# EAGLE design BlueESC (EAGLE 7.4.0)

## Sheet 1 of 6
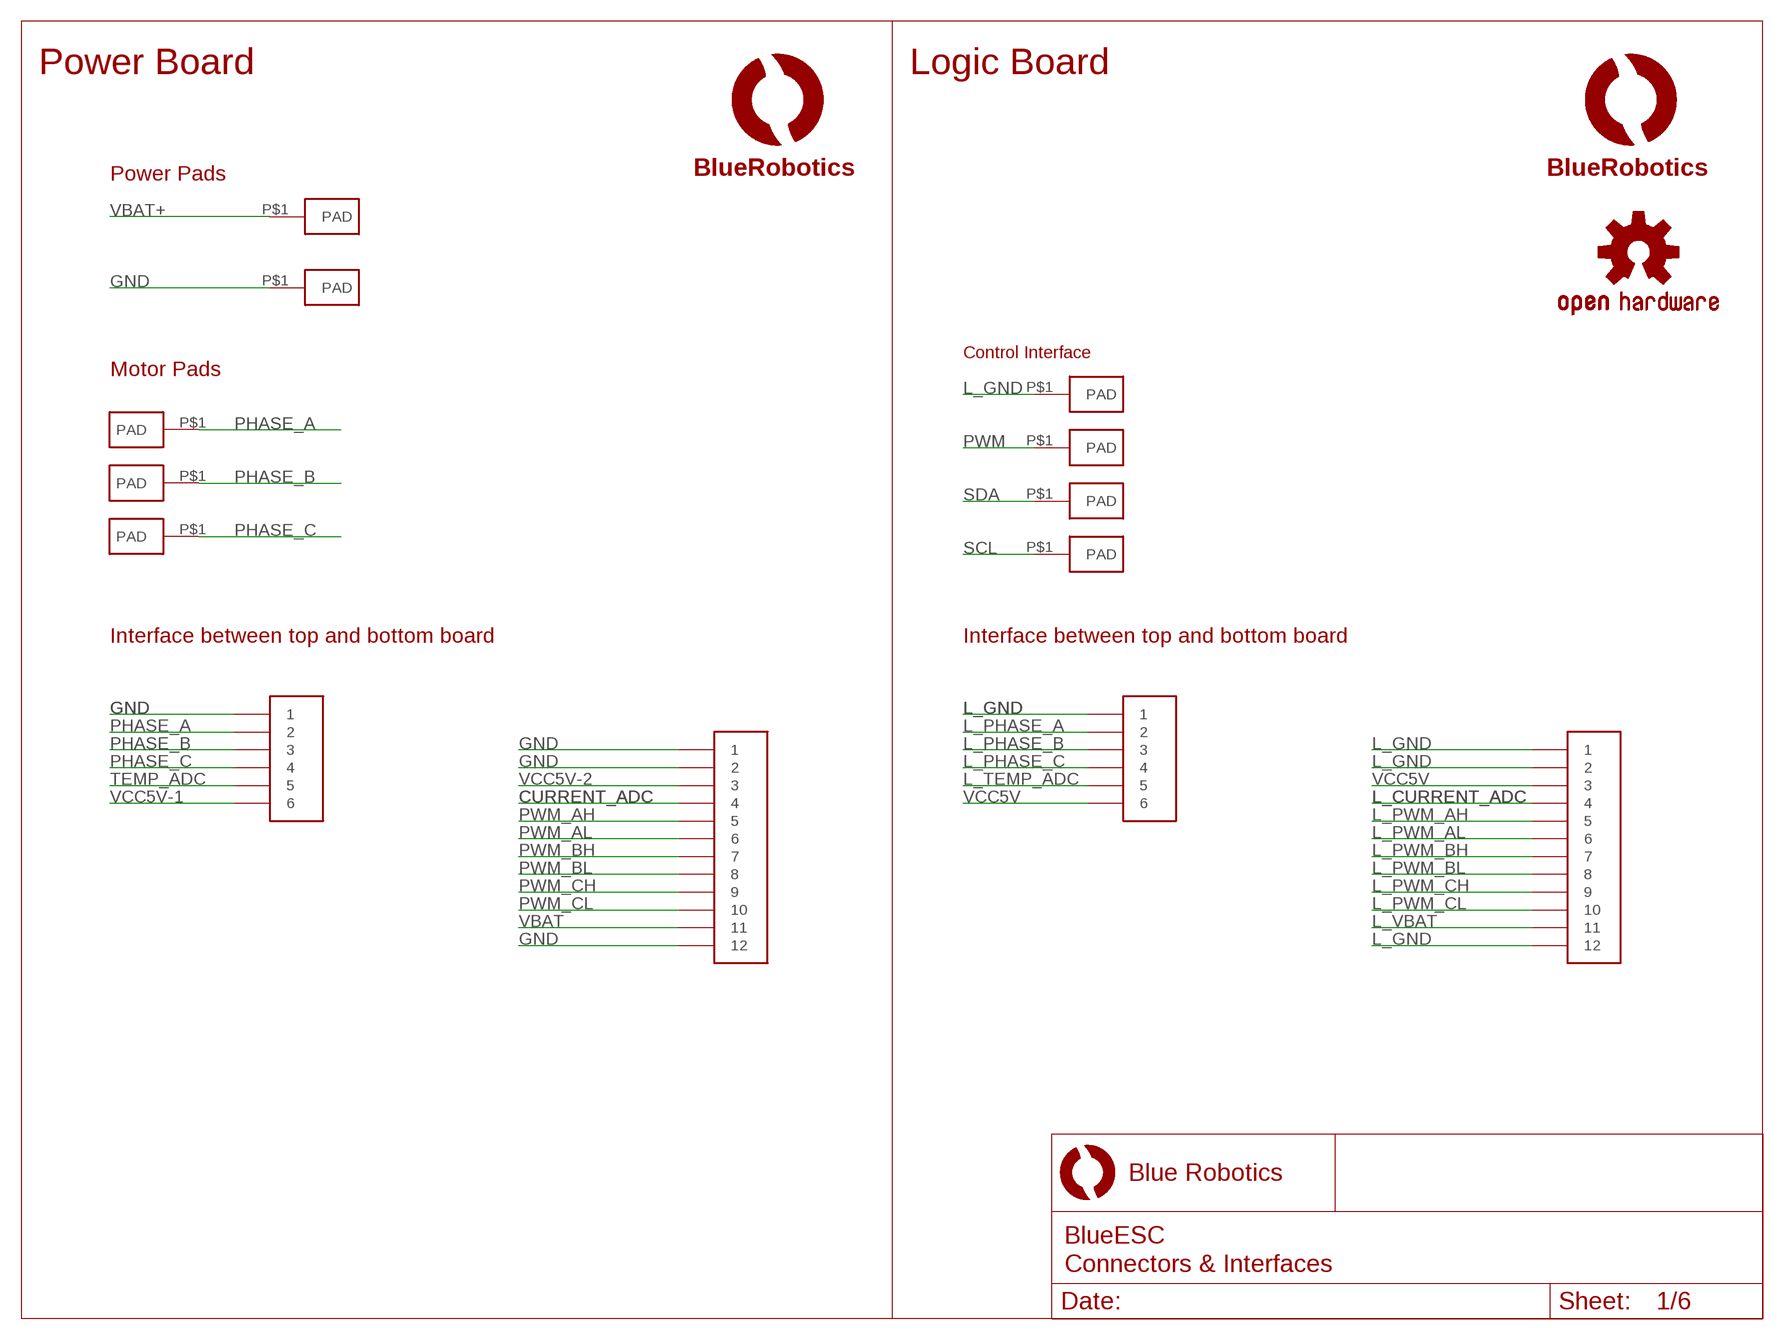
[diagram p0: schematic, sheet 1]

### Parts
LOGO1  OSHW-LOGOS  [OSHW-LOGO-S]
U$1  PADPTH-MED  [PAD-PTH-MED-1]
U$2  PADPTH-MED  [PAD-PTH-MED-1]
U$4  HEADER-62MM  [HEADER-2MM-6POS]
U$5  PAD18AWG  [PAD-PTH-18AWG-1]
U$6  PAD18AWG  [PAD-PTH-18AWG-1]
U$7  PAD18AWG  [PAD-PTH-18AWG-1]
U$8  HEADER-122MM  [HEADER-2MM-12POS]
U$9  LOGOBR-LOGO-S  [BR-LOGO-SMALL]
U$10  LOGOBR-LOGO-M  [BR-LOGO-MEDIUM]
U$11  PAD1.5X3MM  [PAD-1.5X3MM]
U$12  PAD1.5X3MM  [PAD-1.5X3MM]
U$13  PAD1.5X3MM  [PAD-1.5X3MM]
U$14  PAD1.5X3MM  [PAD-1.5X3MM]
U$16  HEADER-62MM  [HEADER-2MM-6POS]
U$17  HEADER-122MM  [HEADER-2MM-12POS]

### Nets
CURRENT_ADC: U$8.P$4 ; also sheet 3
GND: U$2.P$1(PAD) U$4.P$1 U$8.P$1 U$8.P$2 U$8.P$12 ; also sheet 3,4,6
L_CURRENT_ADC: U$17.P$4 ; also sheet 3
L_GND: U$11.P$1(PAD) U$16.P$1 U$17.P$1 U$17.P$2 U$17.P$12 ; also sheet 2,3,4,5
L_PHASE_A: U$16.P$2 ; also sheet 5
L_PHASE_B: U$16.P$3 ; also sheet 5
L_PHASE_C: U$16.P$4 ; also sheet 5
L_PWM_AH: U$17.P$5 ; also sheet 2
L_PWM_AL: U$17.P$6 ; also sheet 2
L_PWM_BH: U$17.P$7 ; also sheet 2
L_PWM_BL: U$17.P$8 ; also sheet 2
L_PWM_CH: U$17.P$9 ; also sheet 2
L_PWM_CL: U$17.P$10 ; also sheet 2
L_TEMP_ADC: U$16.P$5 ; also sheet 2
L_VBAT: U$17.P$11 ; also sheet 3,4
PHASE_A: U$4.P$2 U$5.P$1(PAD) ; also sheet 6
PHASE_B: U$4.P$3 U$6.P$1(PAD) ; also sheet 6
PHASE_C: U$4.P$4 U$7.P$1(PAD) ; also sheet 6
PWM: U$14.P$1(PAD) ; also sheet 2
PWM_AH: U$8.P$5 ; also sheet 6
PWM_AL: U$8.P$6 ; also sheet 6
PWM_BH: U$8.P$7 ; also sheet 6
PWM_BL: U$8.P$8 ; also sheet 6
PWM_CH: U$8.P$9 ; also sheet 6
PWM_CL: U$8.P$10 ; also sheet 6
SCL: U$13.P$1(PAD) ; also sheet 2
SDA: U$12.P$1(PAD) ; also sheet 2
TEMP_ADC: U$4.P$5 ; also sheet 3
VBAT: U$8.P$11 ; also sheet 3,6
VBAT+: U$1.P$1(PAD) ; also sheet 3,4
VCC5V: U$16.P$6 U$17.P$3 ; also sheet 2,4
VCC5V-1: U$4.P$6 ; also sheet 3
VCC5V-2: U$8.P$3 ; also sheet 3

### Notes on the sheet
- Power Board | Logic Board
- Power Pads
- Control Interface
- Motor Pads
- Interface between top and bottom board | Interface between top and bottom board

## Sheet 2 of 6
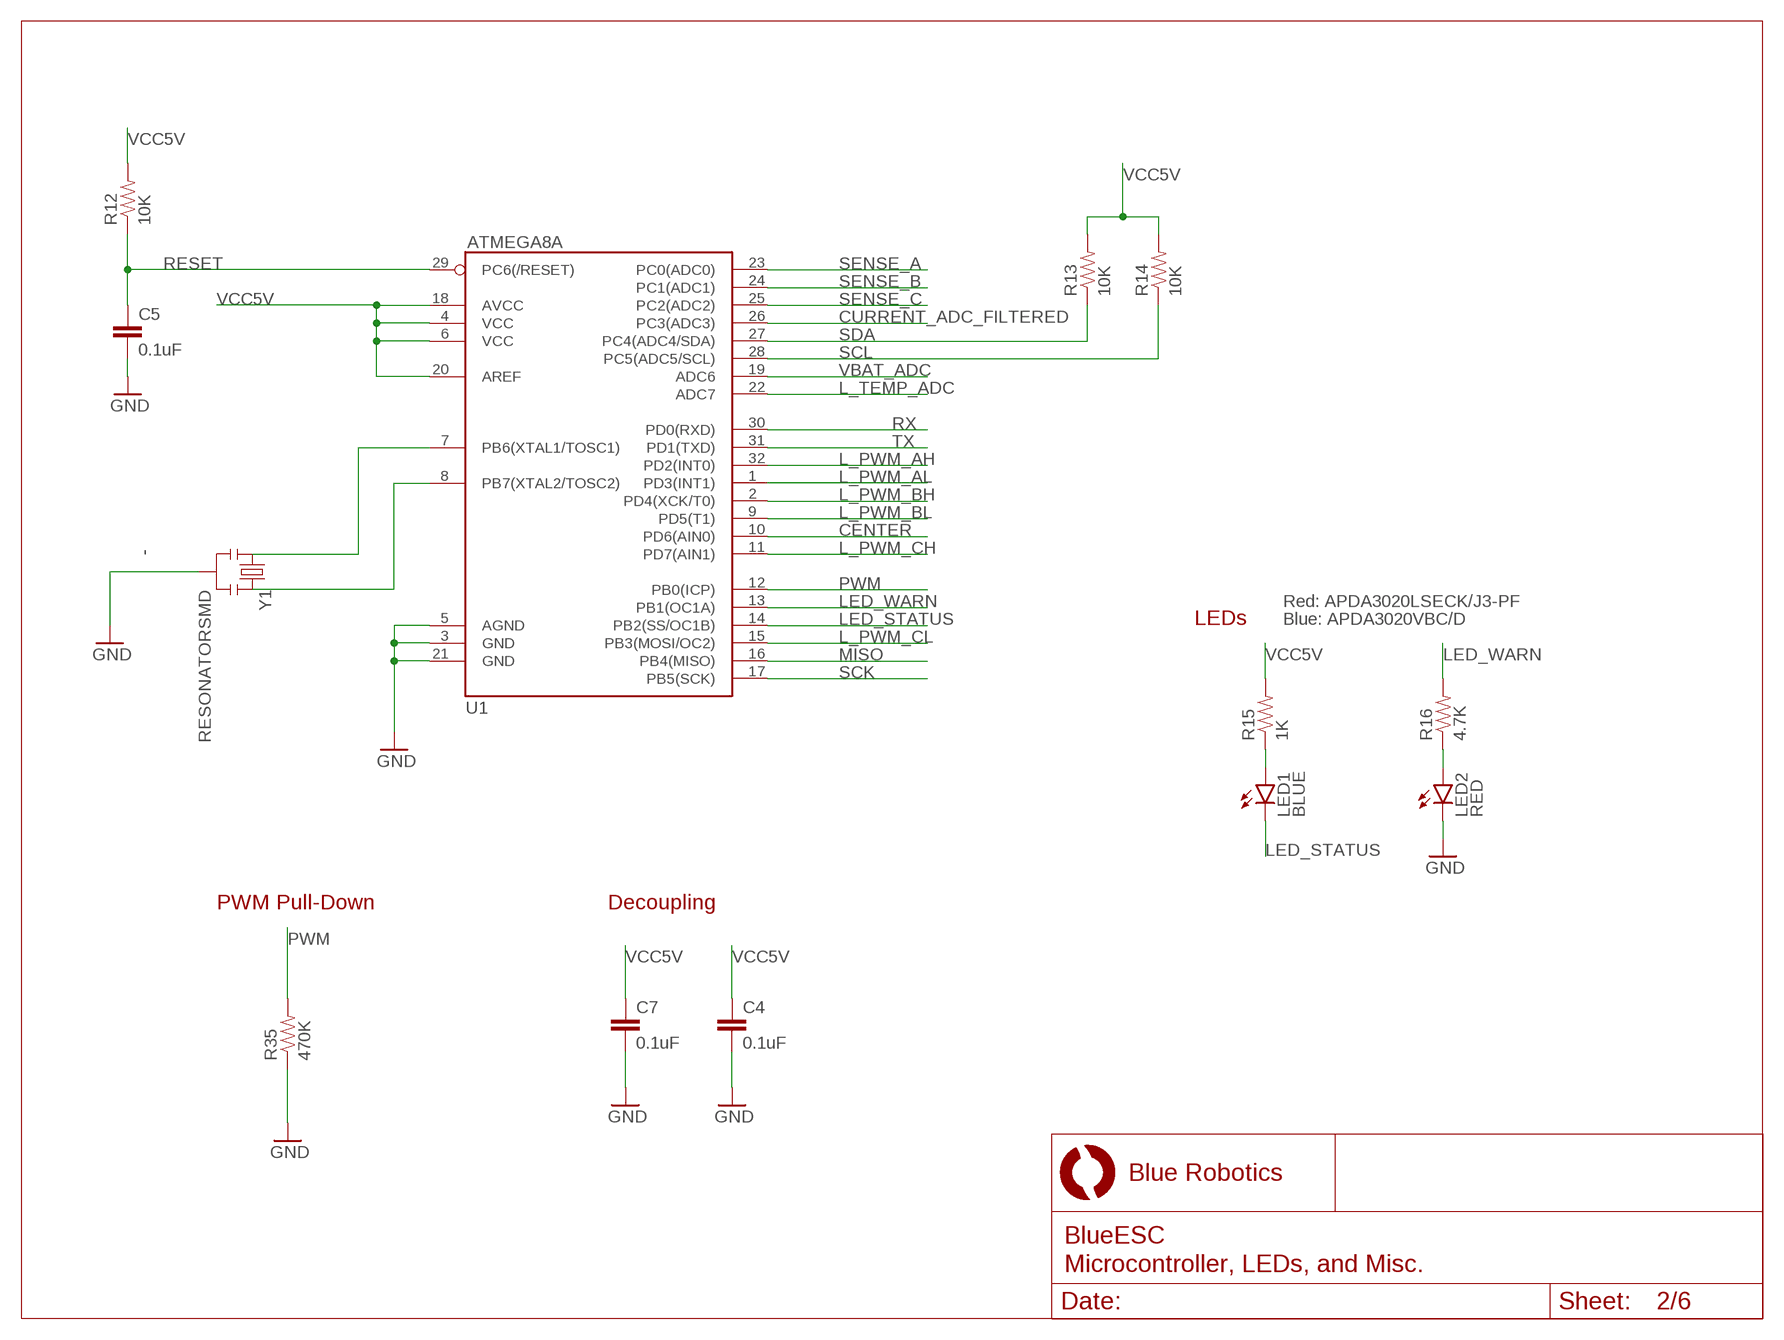
[diagram p1: schematic, sheet 2]

### Parts
C4  0.1uF  CAP0603-CAP  [0603-CAP]
C5  0.1uF  CAP0603-CAP  [0603-CAP]
C7  0.1uF  CAP0603-CAP  [0603-CAP]
LED1  BLUE  LED3X2-RA  [SMT-LED-3X2-RA]
LED2  RED  LED3X2-RA  [SMT-LED-3X2-RA]
R12  10K  33KOHM1/10W1%(0603)  [0603-RES]
R13  10K  33KOHM1/10W1%(0603)  [0603-RES]
R14  10K  33KOHM1/10W1%(0603)  [0603-RES]
R15  1K  RESISTOR0603-RES  [0603-RES]
R16  4.7K  RESISTOR0603-RES  [0603-RES]
R35  470K  RESISTOR0603-RES  [0603-RES]
U1  ATMEGA168  [TQFP32-08]
Y1  RESONATORSMD  [RESONATOR-SMD]

### Nets
CENTER: U1.10(PD6(AIN0)) ; also sheet 5
CURRENT_ADC_FILTERED: U1.26(PC3(ADC3)) ; also sheet 3
L_GND: C4.2 C5.2 C7.2 LED2.2(C) R35.1 U1.3(GND) U1.5(AGND) U1.21(GND) Y1.2 ; supply symbol labelled GND ; also sheet 1,3,4,5
L_PWM_AH: U1.32(PD2(INT0)) ; also sheet 1
L_PWM_AL: U1.1(PD3(INT1)) ; also sheet 1
L_PWM_BH: U1.2(PD4(XCK/T0)) ; also sheet 1
L_PWM_BL: U1.9(PD5(T1)) ; also sheet 1
L_PWM_CH: U1.11(PD7(AIN1)) ; also sheet 1
L_PWM_CL: U1.15(PB3(MOSI/OC2)) ; also sheet 1
L_TEMP_ADC: U1.22(ADC7) ; also sheet 1
LED_STATUS: LED1.2(C) U1.14(PB2(SS/OC1B))
LED_WARN: R16.2 U1.13(PB1(OC1A))
MISO: U1.16(PB4(MISO))
N$3: LED2.1(A) R16.1
N$10: U1.7(PB6(XTAL1/TOSC1)) Y1.1
N$11: U1.8(PB7(XTAL2/TOSC2)) Y1.3
N$16: LED1.1(A) R15.1
PWM: R35.2 U1.12(PB0(ICP)) ; also sheet 1
RESET: C5.1 R12.1 U1.29(PC6(/RESET))
RX: U1.30(PD0(RXD))
SCK: U1.17(PB5(SCK))
SCL: R14.1 U1.28(PC5(ADC5/SCL)) ; also sheet 1
SDA: R13.1 U1.27(PC4(ADC4/SDA)) ; also sheet 1
SENSE_A: U1.23(PC0(ADC0)) ; also sheet 5
SENSE_B: U1.24(PC1(ADC1)) ; also sheet 5
SENSE_C: U1.25(PC2(ADC2)) ; also sheet 5
TX: U1.31(PD1(TXD))
VBAT_ADC: U1.19(ADC6) ; also sheet 3
VCC5V: C4.1 C7.1 R12.2 R13.2 R14.2 R15.2 U1.4(VCC) U1.6(VCC) U1.18(AVCC) U1.20(AREF) ; also sheet 1,4

### Notes on the sheet
- ATMEGA8A
- Red: APDA3020LSECK/J3-PF
- LEDs | Blue: APDA3020VBC/D
- PWM Pull-Down | Decoupling

## Sheet 3 of 6
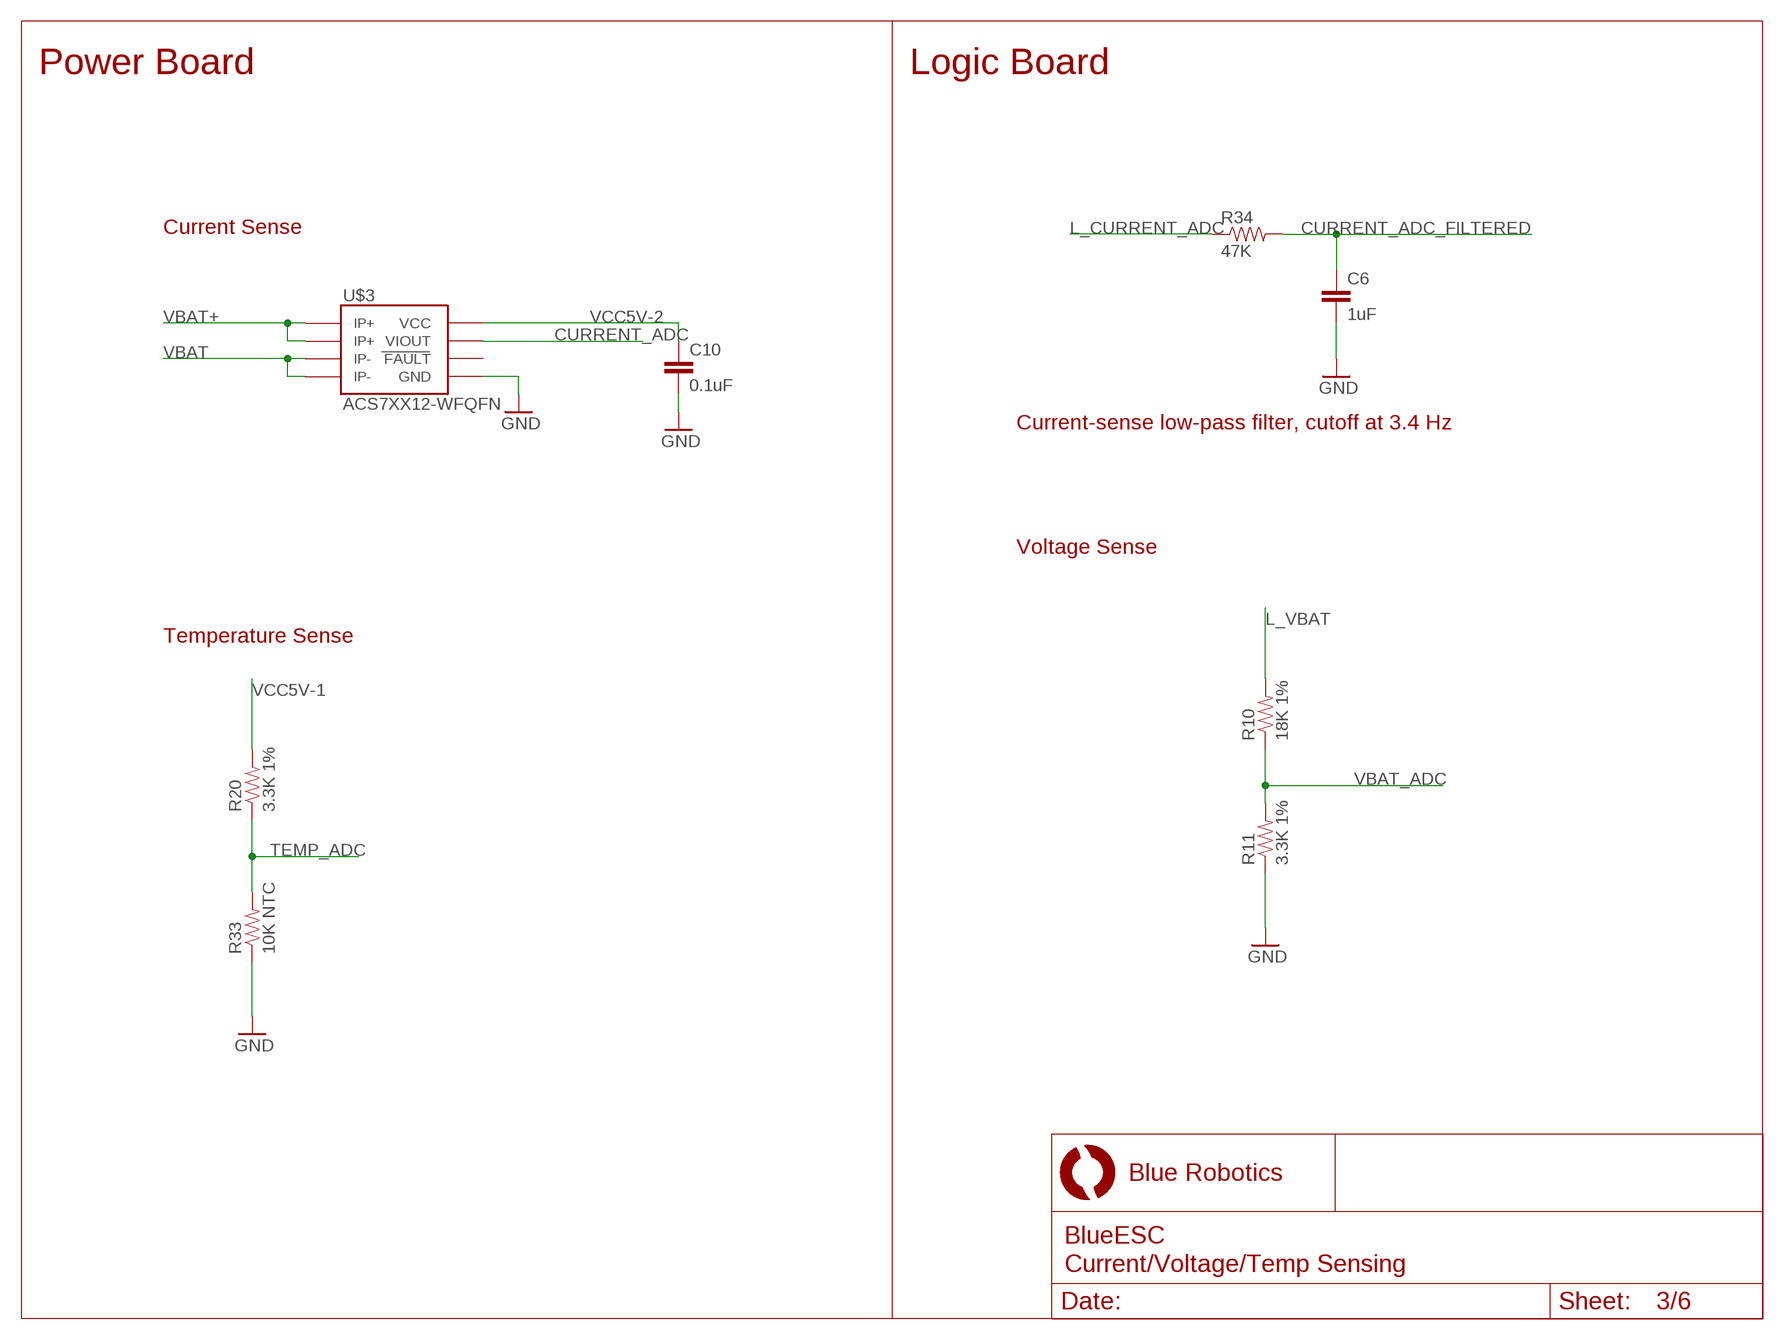
[diagram p2: schematic, sheet 3]

### Parts
C6  1uF  CAP0603-CAP  [0603-CAP]
C10  0.1uF  CAP0603-CAP  [0603-CAP]
R10  18K 1%  33KOHM1/10W1%(0603)  [0603-RES]
R11  3.3K 1%  33KOHM1/10W1%(0603)  [0603-RES]
R20  3.3K 1%  33KOHM1/10W1%(0603)  [0603-RES]
R33  10K NTC  33KOHM1/10W1%(0603)  [0603-RES]
R34  47K  RESISTOR0603-RES  [0603-RES]
U$3  ACS7XX12-WFQFN  [12-WFQFN]

### Nets
CURRENT_ADC: U$3.VIOUT ; also sheet 1
CURRENT_ADC_FILTERED: C6.1 R34.2 ; also sheet 2
GND: C10.2 R33.1 U$3.GND ; also sheet 1,4,6
L_CURRENT_ADC: R34.1 ; also sheet 1
L_GND: C6.2 R11.1 ; supply symbol labelled GND ; also sheet 1,2,4,5
L_VBAT: R10.2 ; also sheet 1,4
TEMP_ADC: R20.1 R33.2 ; also sheet 1
VBAT: U$3.IP-1 U$3.IP-2 ; also sheet 1,6
VBAT+: U$3.IP+1 U$3.IP+2 ; also sheet 1,4
VBAT_ADC: R10.1 R11.2 ; also sheet 2
VCC5V-1: R20.2 ; also sheet 1
VCC5V-2: C10.1 U$3.VCC ; also sheet 1
Unconnected: U$3.FAULT

### Notes on the sheet
- Power Board | Logic Board
- Current Sense
- Current-sense low-pass filter, cutoff at 3.4 Hz
- Voltage Sense
- Temperature Sense

## Sheet 4 of 6
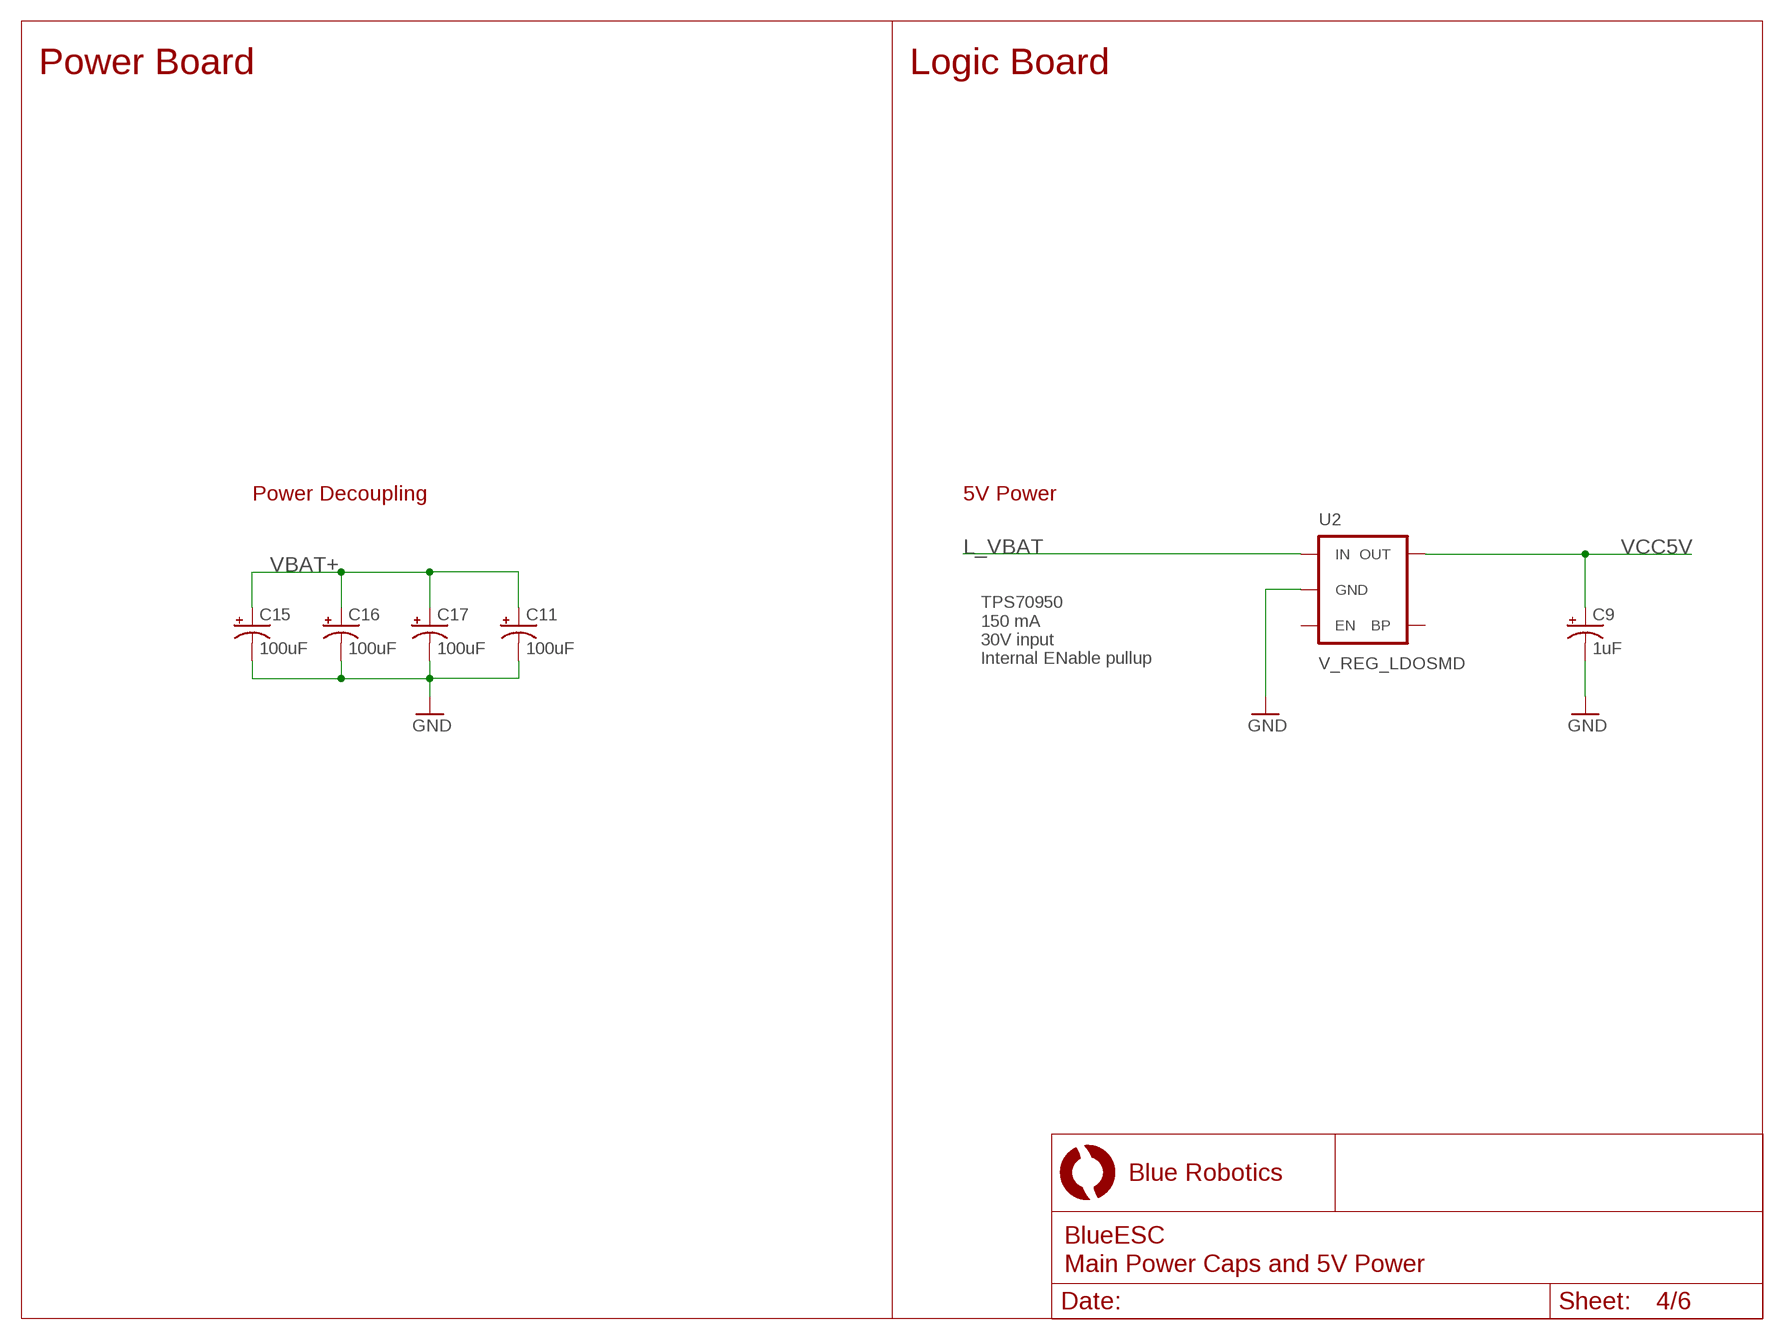
[diagram p3: schematic, sheet 4]

### Parts
C9  1uF  CAP_POL1206  [EIA3216]
C11  100uF  CAP_POL7343  [EIA7343]
C15  100uF  CAP_POL7343  [EIA7343]
C16  100uF  CAP_POL7343  [EIA7343]
C17  100uF  CAP_POL7343  [EIA7343]
U2  V_REG_LDOSMD  [SOT23-5]

### Nets
GND: C11.C(-) C15.C(-) C16.C(-) C17.C(-) ; also sheet 1,3,6
L_GND: C9.C(-) U2.2(GND) ; supply symbol labelled GND ; also sheet 1,2,3,5
L_VBAT: U2.1(IN) ; also sheet 1,3
VBAT+: C11.A(+) C15.A(+) C16.A(+) C17.A(+) ; also sheet 1,3
VCC5V: C9.A(+) U2.5(OUT) ; also sheet 1,2
Unconnected: U2.3(EN) U2.4(BP)

### Notes on the sheet
- Power Board | Logic Board
- Power Decoupling | 5V Power
- TPS70950
  150 mA
  30V input
  Internal ENable pullup

## Sheet 5 of 6
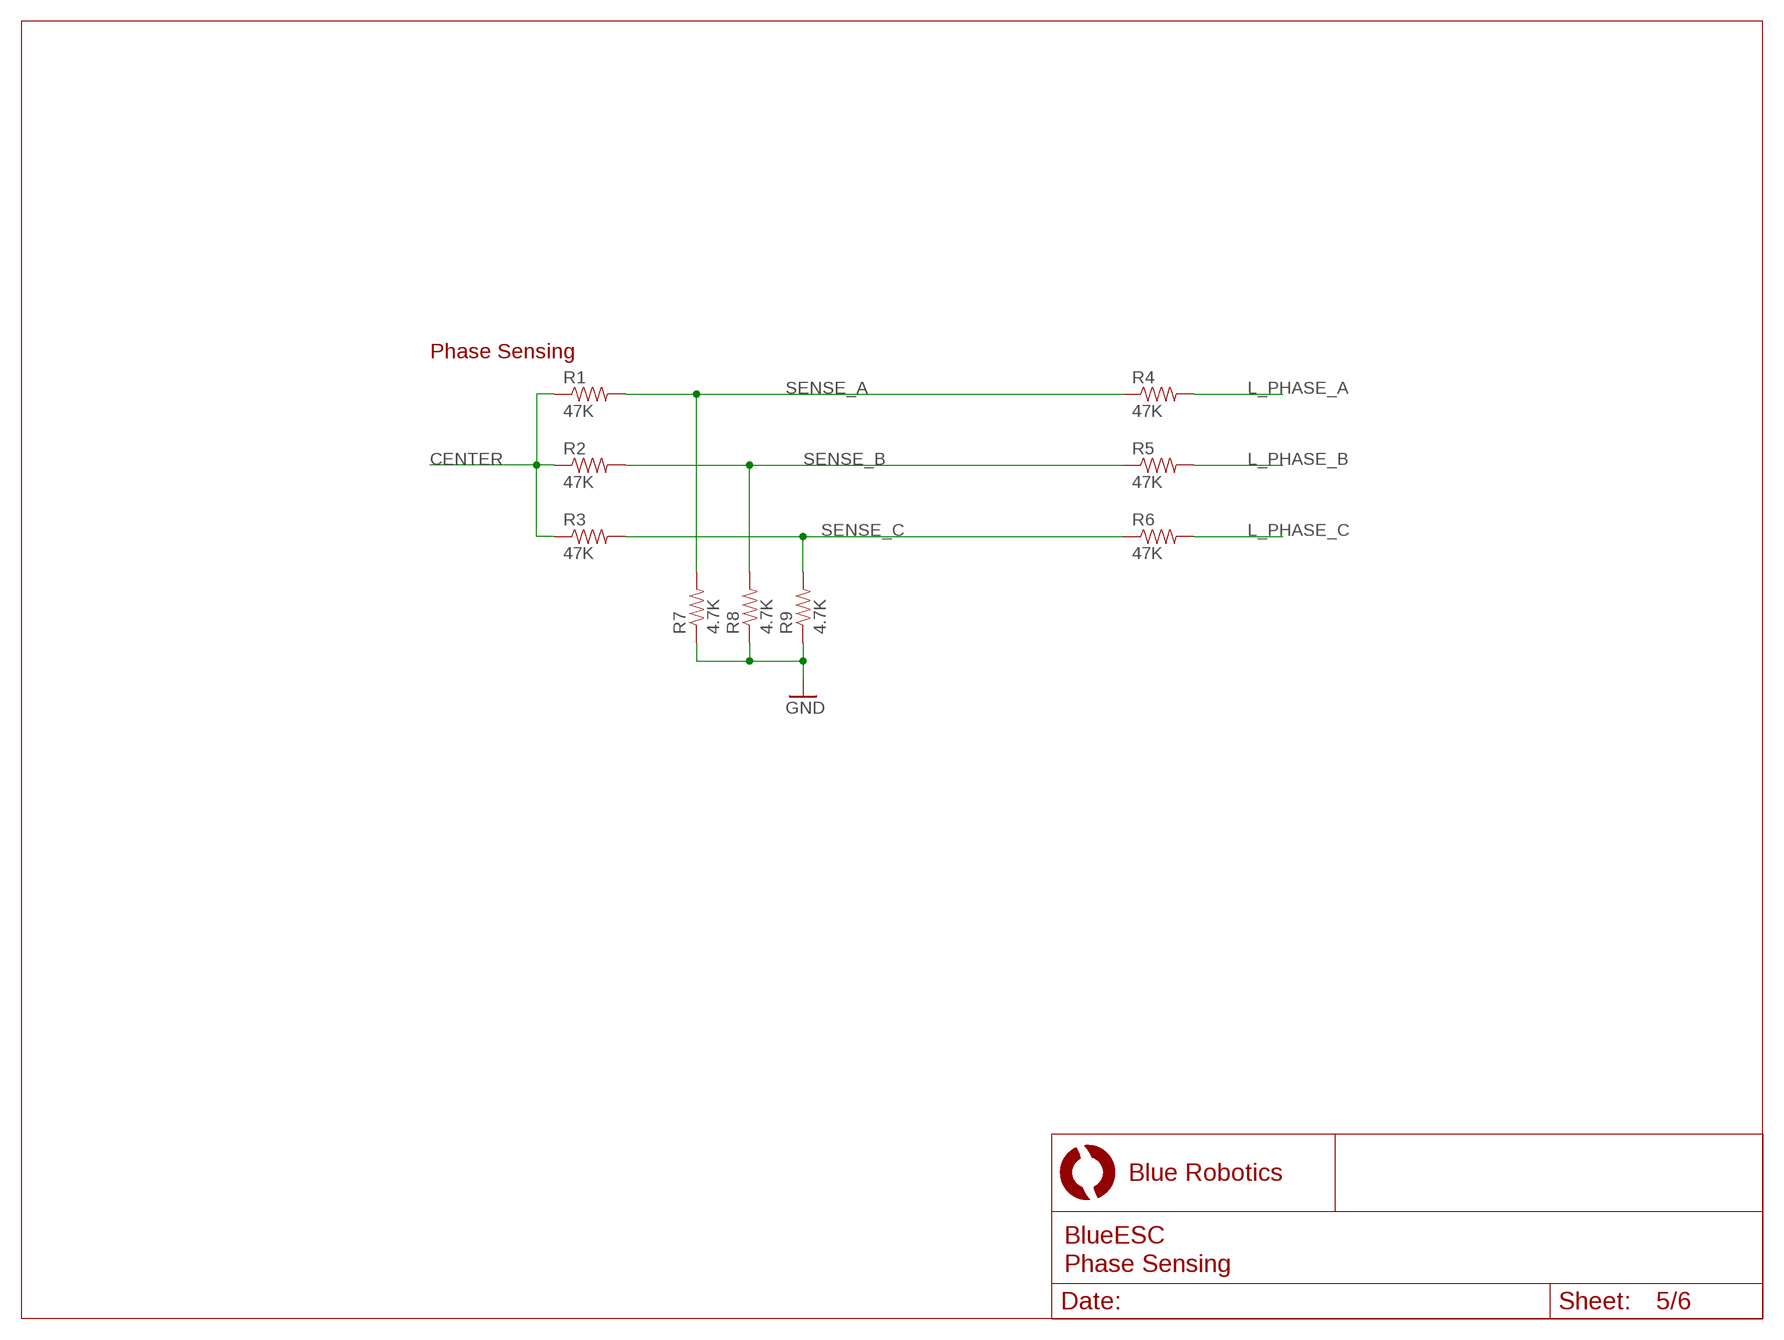
[diagram p4: schematic, sheet 5]

### Parts
R1  47K  33KOHM1/10W1%(0603)  [0603-RES]
R2  47K  33KOHM1/10W1%(0603)  [0603-RES]
R3  47K  33KOHM1/10W1%(0603)  [0603-RES]
R4  47K  33KOHM1/10W1%(0603)  [0603-RES]
R5  47K  33KOHM1/10W1%(0603)  [0603-RES]
R6  47K  33KOHM1/10W1%(0603)  [0603-RES]
R7  4.7K  RESISTOR0603  [0603-RES]
R8  4.7K  RESISTOR0603  [0603-RES]
R9  4.7K  RESISTOR0603  [0603-RES]

### Nets
CENTER: R1.1 R2.1 R3.1 ; also sheet 2
L_GND: R7.1 R8.1 R9.1 ; supply symbol labelled GND ; also sheet 1,2,3,4
L_PHASE_A: R4.2 ; also sheet 1
L_PHASE_B: R5.2 ; also sheet 1
L_PHASE_C: R6.2 ; also sheet 1
SENSE_A: R1.2 R4.1 R7.2 ; also sheet 2
SENSE_B: R2.2 R5.1 R8.2 ; also sheet 2
SENSE_C: R3.2 R6.1 R9.2 ; also sheet 2

### Notes on the sheet
- Phase Sensing

## Sheet 6 of 6
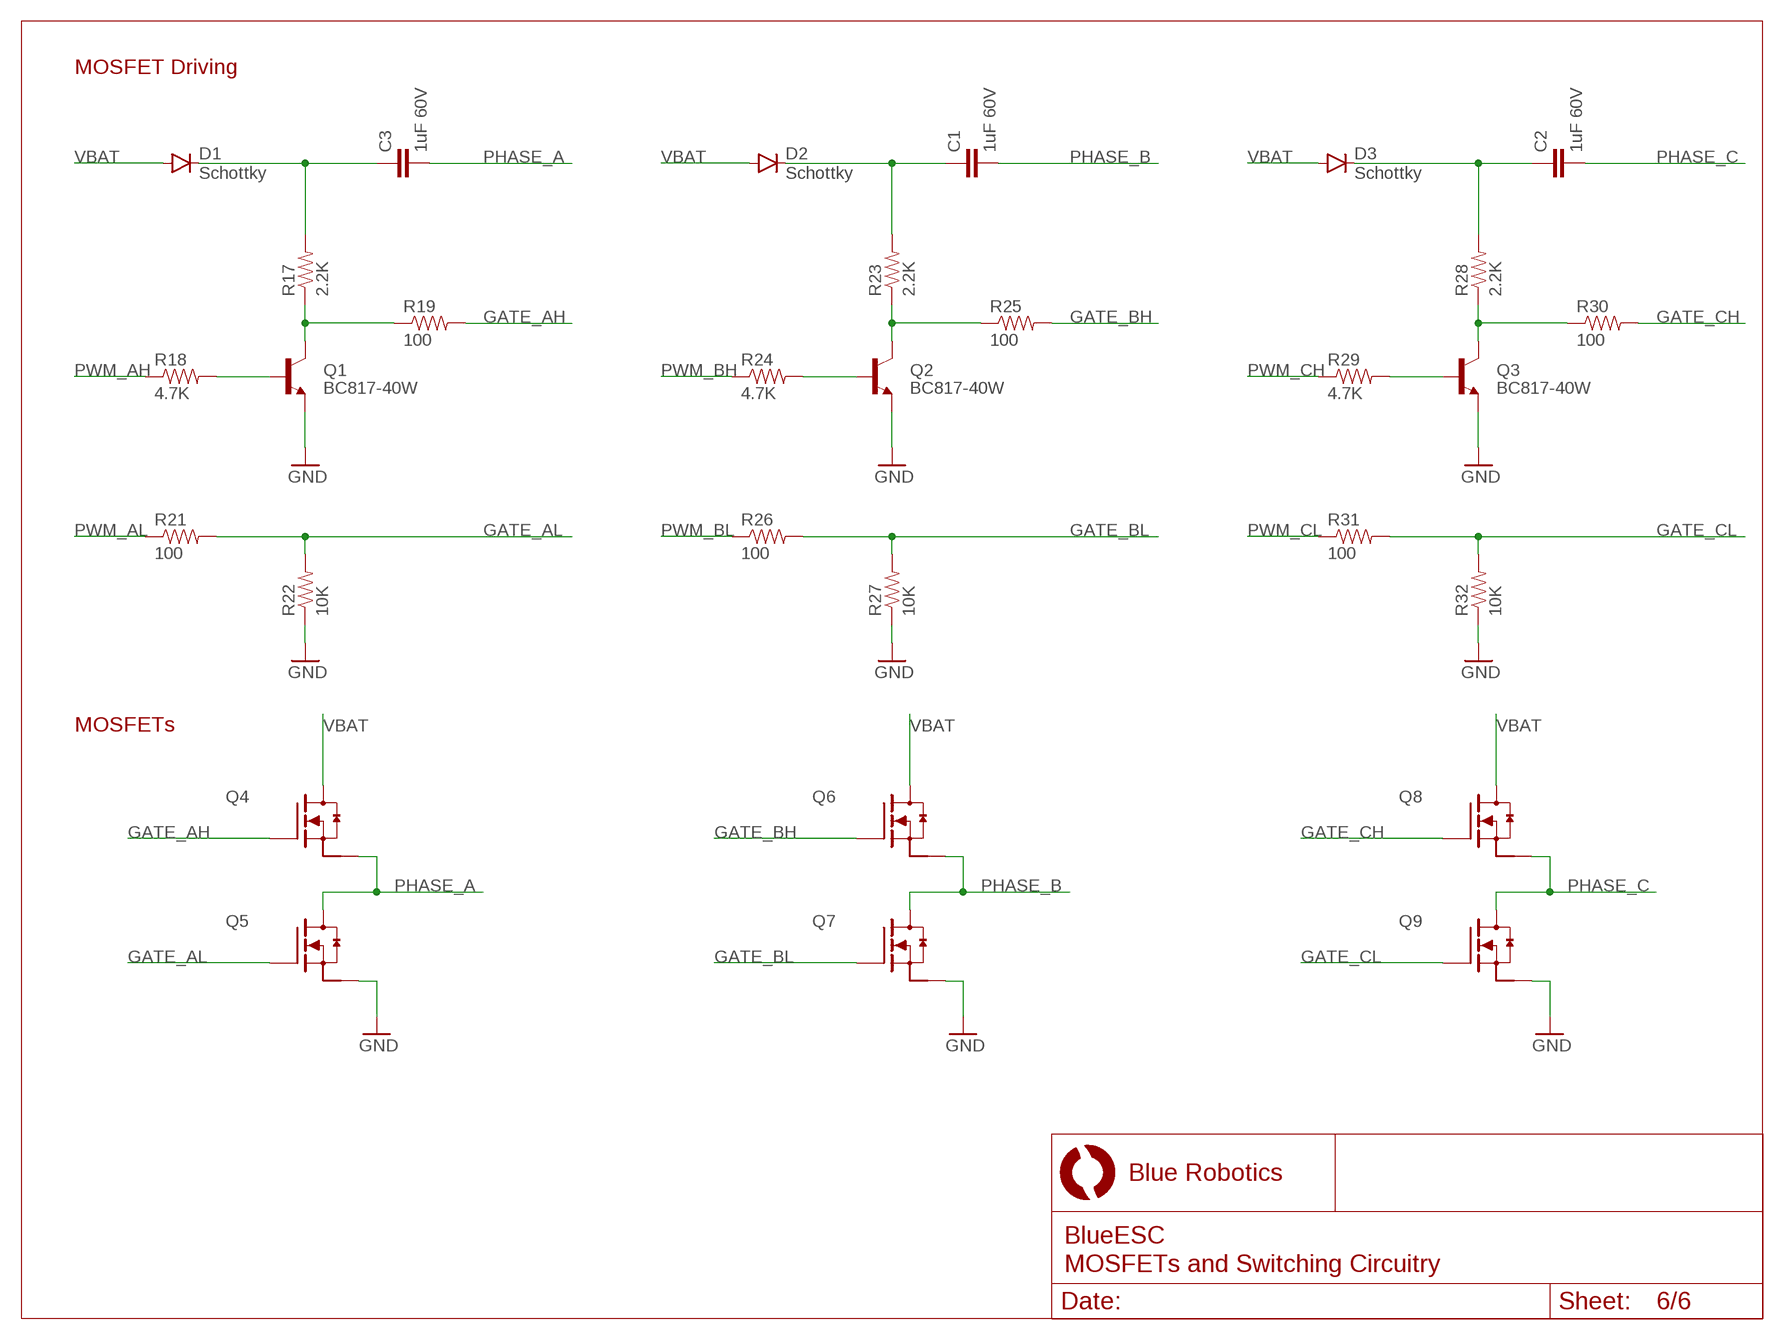
[diagram p5: schematic, sheet 6]

### Parts
C1  1uF 60V  CAP0805  [0805]
C2  1uF 60V  CAP0805  [0805]
C3  1uF 60V  CAP0805  [0805]
D1  Schottky  DIODESOD  [SOD-323]
D2  Schottky  DIODESOD  [SOD-323]
D3  Schottky  DIODESOD  [SOD-323]
Q1  BC817-40W  TRANSISTOR_NPNSOT23  [SOT23]
Q2  BC817-40W  TRANSISTOR_NPNSOT23  [SOT23]
Q3  BC817-40W  TRANSISTOR_NPNSOT23  [SOT23]
Q4  MOSFET-NCHANNEL  [TDSON-8]
Q5  MOSFET-NCHANNEL  [TDSON-8]
Q6  MOSFET-NCHANNEL  [TDSON-8]
Q7  MOSFET-NCHANNEL  [TDSON-8]
Q8  MOSFET-NCHANNEL  [TDSON-8]
Q9  MOSFET-NCHANNEL  [TDSON-8]
R17  2.2K  33KOHM1/10W1%(0603)  [0603-RES]
R18  4.7K  33KOHM1/10W1%(0603)  [0603-RES]
R19  100  33KOHM1/10W1%(0603)  [0603-RES]
R21  100  33KOHM1/10W1%(0603)  [0603-RES]
R22  10K  33KOHM1/10W1%(0603)  [0603-RES]
R23  2.2K  33KOHM1/10W1%(0603)  [0603-RES]
R24  4.7K  33KOHM1/10W1%(0603)  [0603-RES]
R25  100  33KOHM1/10W1%(0603)  [0603-RES]
R26  100  33KOHM1/10W1%(0603)  [0603-RES]
R27  10K  33KOHM1/10W1%(0603)  [0603-RES]
R28  2.2K  33KOHM1/10W1%(0603)  [0603-RES]
R29  4.7K  33KOHM1/10W1%(0603)  [0603-RES]
R30  100  33KOHM1/10W1%(0603)  [0603-RES]
R31  100  33KOHM1/10W1%(0603)  [0603-RES]
R32  10K  33KOHM1/10W1%(0603)  [0603-RES]

### Nets
GATE_AH: Q4.G R19.2
GATE_AL: Q5.G R21.2 R22.2
GATE_BH: Q6.G R25.2
GATE_BL: Q7.G R26.2 R27.2
GATE_CH: Q8.G R30.2
GATE_CL: Q9.G R31.2 R32.2
GND: Q1.2(E) Q2.2(E) Q3.2(E) Q5.S1(S) Q5.S2(S) Q5.S3(S) Q7.S1(S) Q7.S2(S) Q7.S3(S) Q9.S1(S) Q9.S2(S) Q9.S3(S) R22.1 R27.1 R32.1 ; also sheet 1,3,4
N$2: Q1.1(B) R18.2
N$4: Q1.3(C) R17.1 R19.1
N$5: Q2.1(B) R24.2
N$6: Q2.3(C) R23.1 R25.1
N$7: Q3.1(B) R29.2
N$9: Q3.3(C) R28.1 R30.1
N$12: C3.1 D1.C R17.2
N$15: C1.1 D2.C R23.2
N$19: C2.1 D3.C R28.2
PHASE_A: C3.2 Q4.S1(S) Q4.S2(S) Q4.S3(S) Q5.D ; also sheet 1
PHASE_B: C1.2 Q6.S1(S) Q6.S2(S) Q6.S3(S) Q7.D ; also sheet 1
PHASE_C: C2.2 Q8.S1(S) Q8.S2(S) Q8.S3(S) Q9.D ; also sheet 1
PWM_AH: R18.1 ; also sheet 1
PWM_AL: R21.1 ; also sheet 1
PWM_BH: R24.1 ; also sheet 1
PWM_BL: R26.1 ; also sheet 1
PWM_CH: R29.1 ; also sheet 1
PWM_CL: R31.1 ; also sheet 1
VBAT: D1.A D2.A D3.A Q4.D Q6.D Q8.D ; also sheet 1,3

### Notes on the sheet
- MOSFET Driving
- MOSFETs

## Library data of the parts
C1-C7 C10 = SparkFun-Capacitors:CAP: Capacitor Standard 0603 ceramic capacitor, and 0.1" leaded capacitor.
C9 C11 C15-C17 = SparkFun-Capacitors:CAP_POL: Capacitor Polarized These are standard SMD and PTH capacitors. Normally 10uF, 47uF, and 100uF in electrolytic and tantalum varieties. Always verify the external diameter of the through hole cap, it varies with capacity, voltage, and manufacturer. The EIA devices should be standard.
D1-D3 = SparkFun-DiscreteSemi:DIODE: Diode These are standard reverse protection diodes and small signal diodes. SMA package can handle up to about 1A. SOD-323 can handle about 200mA. What the SOD-323 package when ordering, there are some mfgs out there that are 5-pin packages.; PROD_ID: DIO-09646
LED1 LED2 = BR-Eagle-Library:LED: LEDs Standard schematic elements and footprints for 5mm, 3mm, 1206, and 0603 sized LEDs. 5mm - Spark Fun Electronics SKU : COM-00529 (and others)
LOGO1 = SparkFun-Aesthetics:OSHW-LOGO: Open Source Hardware Logo This logo indicates the piece of hardware it is found on incorporates a OSHW license and/or adheres to the definition of open source hardware found here: http://freedomdefined.org/OSHW
Q1-Q3 = SparkFun-DiscreteSemi:TRANSISTOR_NPN: Generic NPN BJT MMBT2222A - TRANS-08049 (SOT-23, 1A 40V) MPSA42 - TRANS-09116 (SOT-23, 500mA 300V) MMBT5088LT1G - TRANS-11160 (SOT-23, 50 mA 30V) BC547 - COM-08928 <http://www.sparkfun.com/products/8928> (TO-92 45V 100mA) (1.Collector 2.Base 3.Emitter) 2N3904 - COM-00521 <http://www.sparkfun.com/products/521> (TO-92 40V 200mA) (1.Emitter 2.Base 3.Collector) P2N2222A - COM-12852 <http://www.sparkfun.com/products/12852> (TO-92 40V 600mA) (1.Collector 2.Base 3.Emitter)
Q4-Q9 = BlueRobotics-Main:MOSFET-NCHANNEL
R1-R6 R10-R14 R17-R33 = SparkFun-Resistors:33KOHM1/10W1%(0603): RES-08416
R7-R9 = SparkFun-Resistors:RESISTOR: Resistor Basic schematic elements and footprints for 0603, 1206, and PTH resistors.
R15 R16 R34 R35 = SparkFun:RESISTOR: Resistor Basic schematic elements and footprints for 0603, 1206, and PTH resistors.
U1 = SparkFun-DigitalIC:ATMEGA168: Atmel 32-pin 8-bit micro, 16k flash.
U2 = SparkFun-PowerIC:V_REG_LDO: Voltage Regulator LDO Standard 150mA LDO voltage regulator in SOT-23 layout. Micrel part MIC5205. BP (by-pass) pin is used to lower output noise with 470pF cap.
U$1 U$2 U$5-U$7 U$11-U$14 = BR-Eagle-Library:PAD
U$3 = BR-Eagle-Library:ACS7XX
U$4 U$16 = BR-Eagle-Library:HEADER-6
U$8 U$17 = BR-Eagle-Library:HEADER-12
U$9 U$10 = BR-Eagle-Library:LOGO
Y1 = SparkFun:RESONATOR: Resonator Small SMD resonator. This is the itty bitty 10/20MHz resonators with built in caps. CSTCE10M0G55 and CSTCE20M0V53. Footprint has been reviewed closely but hasn't been tested yet.

## Board
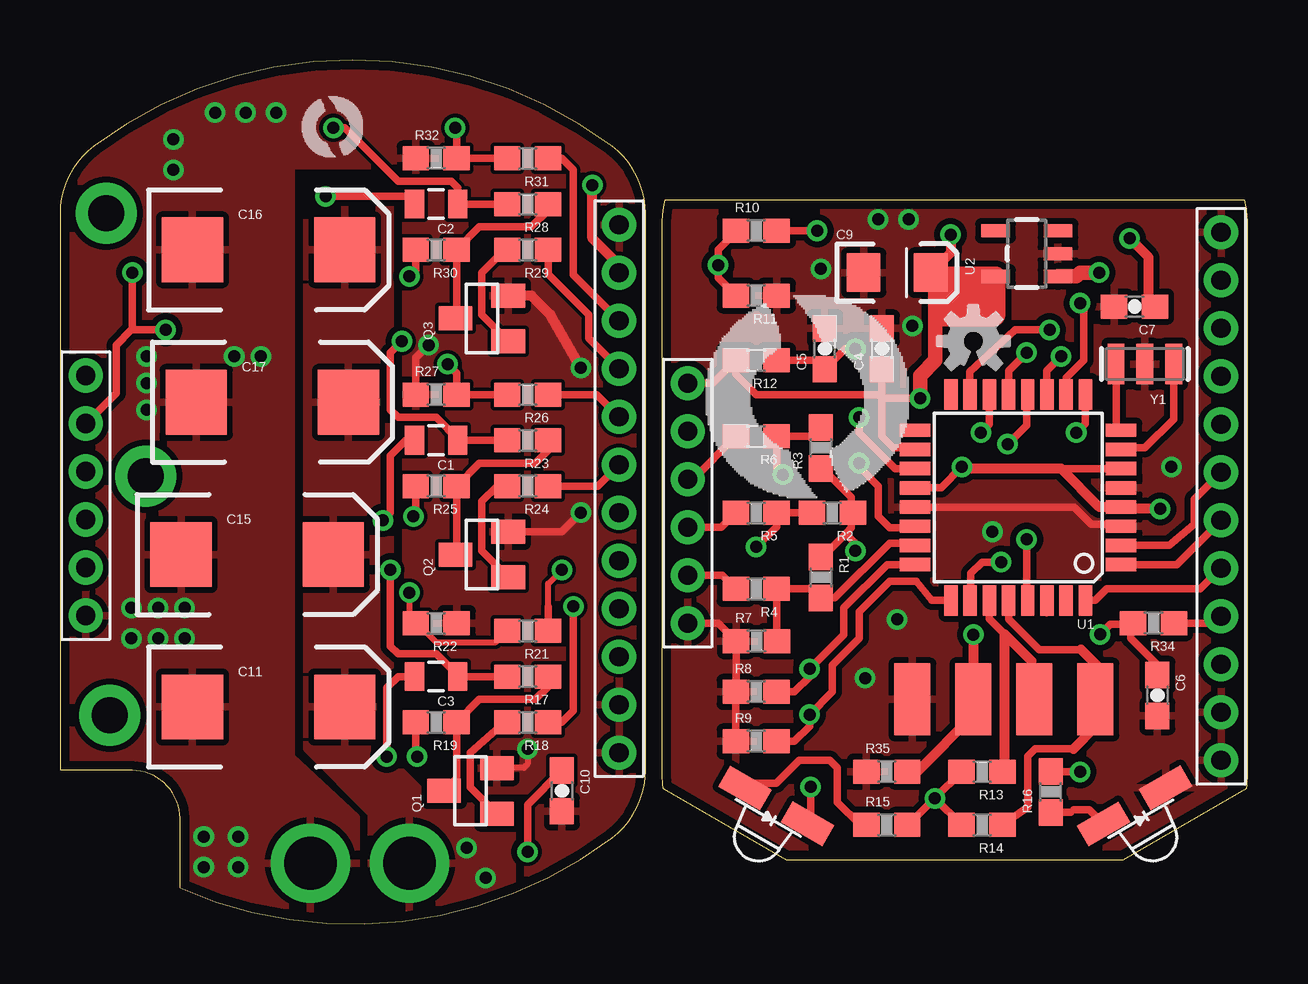
[diagram p6: board, top side]
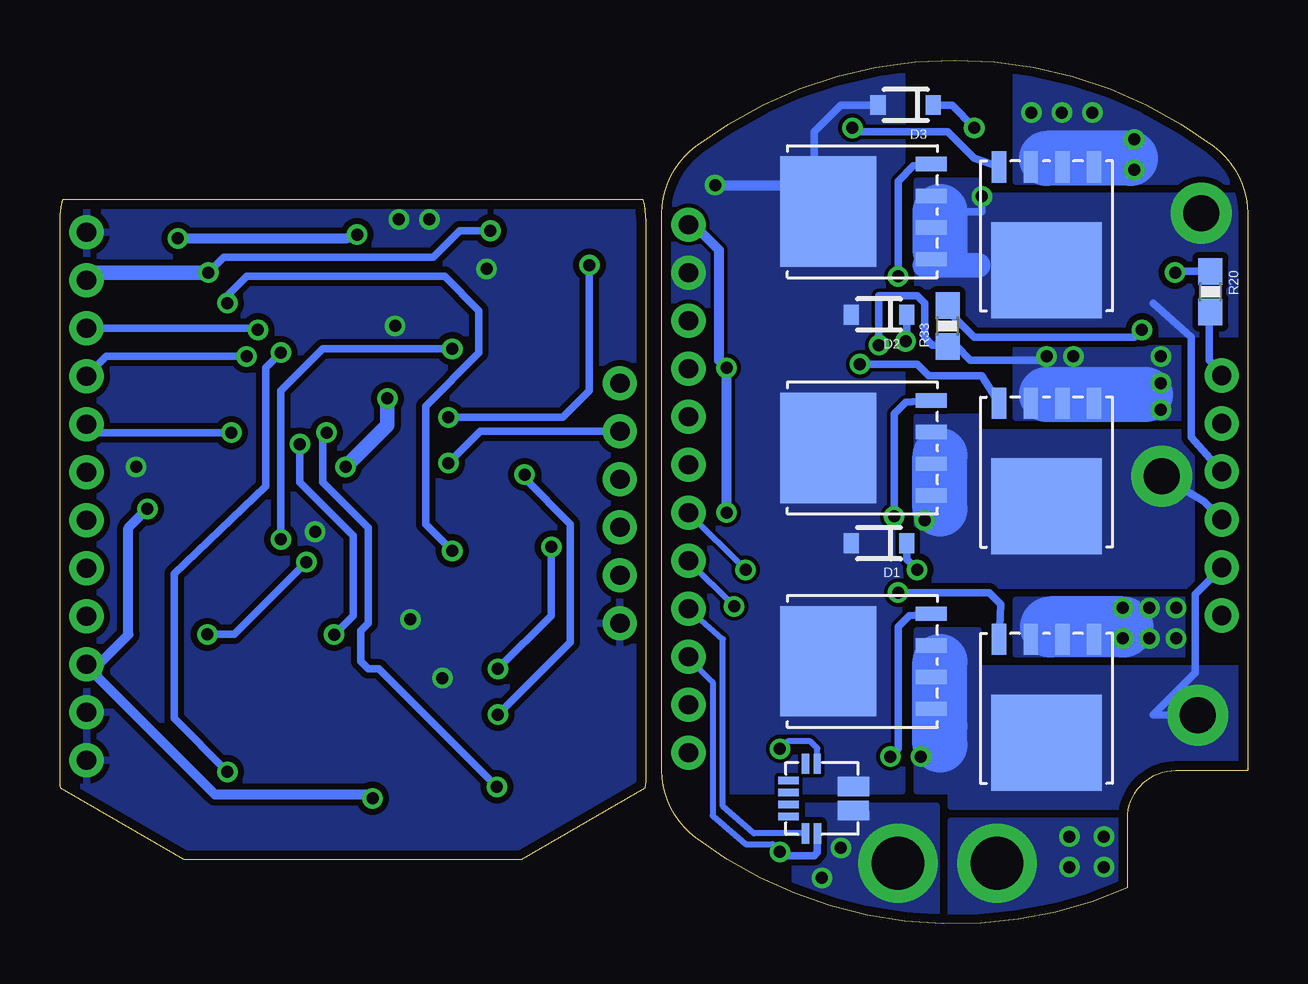
[diagram p7: board, bottom side, seen from below]

Size 49.48 x 35.99 mm. Coordinates in mm from the lower left corner, seen from the top.
Outline: 49.36,30.17 25.2,30.17 arc15 25.08,29.27 25.08,6.07 arc7 25.11,5.65 30.26,2.67 44.3,2.67 49.45,5.65 arc7 49.48,6.07 49.48,29.27 arc15 49.36,30.17
Outline: 49.36,30.17 49.36,30.17
Outline: 5,1.5 5,4.39 arc90 3,6.39 0,6.39 0,29.59 arc-53 1.4,32.39 arc-74 23,32.39 arc-53 24.4,29.59 24.4,6.39 arc-53 23,3.59 arc-60 5,1.5
Copper layers (1*16): Top 0.0356mm / dielectric 1.5011mm / Bottom 0.0356mm
Design rules "OSHPark": minimum track width 6mil, minimum drill 13mil, track to track 6mil, track to pad 6mil, pad to pad 6mil, via to via 6mil, smd to smd 6mil, copper to edge 15mil, drill to drill 6mil, minimum pad ring 7mil, minimum via ring 7mil, stop-mask expansion 3mil, vias tented up to drill 0mil, thermal gap 10mil

### Footprints (pad centres in the part's own frame; a part is rotated, then mirrored left to right if it is on the bottom)
0805 = smd 0.8 x 1.2: 1 -0.9,0; 2 0.9,0
0603-CAP = smd 1.1 x 1: 1 -0.85,0; 2 0.85,0
EIA3216 = smd 1.4 x 1.6: A 1.4,0; C -1.4,0
EIA7343 = smd 2.55 x 2.7: A 3.17,0; C -3.17,0
SOD-323 = smd 0.63 x 0.83: A 1.15,0; C -1.15,0
SMT-LED-3X2-RA = smd 2 x 1: 1 1.5,0; 2 -1.5,0
SOT23 = smd 1 x 1.4: 1 -0.95,-1.1; 2 0.95,-1.1; 3 0,1.1
TDSON-8 = smd 4.6 x 4: D 0,1.8 | smd 0.6 x 1.3: G 1.98,-2.5; S1 -1.98,-2.5; S2 -0.66,-2.5; S3 0.66,-2.5
0603-RES = smd 1.1 x 1: 1 -0.85,0; 2 0.85,0
TQFP32-08 = smd 1.27 x 0.559: 1 -4.293,2.8; 2 -4.293,2; 3 -4.293,1.2; 4 -4.293,0.4; 5 -4.293,-0.4; 6 -4.293,-1.2; 7 -4.293,-2; 8 -4.293,-2.8; 17 4.293,-2.8; 18 4.293,-2; 19 4.293,-1.2; 20 4.293,-0.4; 21 4.293,0.4; 22 4.293,1.2; 23 4.293,2; 24 4.293,2.8 | smd 0.559 x 1.27: 9 -2.8,-4.293; 10 -2,-4.293; 11 -1.2,-4.293; 12 -0.4,-4.293; 13 0.4,-4.293; 14 1.2,-4.293; 15 2,-4.293; 16 2.8,-4.293; 25 2.8,4.293; 26 2,4.293; 27 1.2,4.293; 28 0.4,4.293; 29 -0.4,4.293; 30 -1.2,4.293; 31 -2,4.293; 32 -2.8,4.293
SOT23-5 = smd 0.55 x 1.2: 1 -0.95,-1.3; 2 0,-1.3; 3 0.95,-1.3; 4 0.95,1.3; 5 -0.95,1.3
PAD-PTH-MED-1 = drill 2.2 pad 3.302: P$1 0,0
12-WFQFN = smd 0.3 x 0.85: FAULT 0.683,-1.445; GND 0.185,-1.446; VCC 0.183,1.456; VIOUT 0.683,1.456 | smd 1.3 x 0.4: IP+1 -1.317,0.705; IP+2 -1.315,0.301; IP-1 -1.317,-0.295; IP-2 -1.317,-0.699 | smd 0.85 x 0.3: NC1 1.383,0.754; NC2 1.383,0.256; NC3 1.384,-0.245; NC4 1.385,-0.745
HEADER-2MM-6POS = drill 0.8 pad 1.422: P$1 0,0; P$2 2,0; P$3 4,0; P$4 6,0; P$5 8,0; P$6 10,0
PAD-PTH-18AWG-1 = drill 1.5 pad 2.54: P$1 0,0
HEADER-2MM-12POS = drill 0.8 pad 1.422: P$1 0,0; P$2 2,0; P$3 4,0; P$4 6,0; P$5 8,0; P$6 10,0; P$7 12,0; P$8 14,0; P$9 16,0; P$10 18,0; P$11 20,0; P$12 22,0
PAD-1.5X3MM = smd 3 x 1.5: P$1 0,0
RESONATOR-SMD = smd 0.7 x 1.7: 1 -1.2,0; 2 0,0; 3 1.2,0

### Placement (x,y rotation side)
C1  15.67,20.15 180 top
C2  15.67,29.99 180 top
C3  15.67,10.3 180 top
C4  34.25,23.96 90 top
C5  31.87,23.96 90 top
C6  45.72,9.52 270 top
C7  44.77,25.72 180 top
C9  34.88,27.13 0 top
C10  20.91,5.54 270 top
C11  8.69,9.03 0 top
C15  8.21,15.38 0 top
C16  8.69,28.08 0 top
C17  8.85,21.73 0 top
D1  15.36,15.86 180 bottom
D2  15.36,25.39 180 bottom
D3  14.24,34.12 180 bottom
LED1  29.85,4.91 150.3 top
LED2  44.77,4.91 210.2 top
LOGO1  38.06,24.27 0 top
Q1  17.1,5.54 90 top
Q2  17.58,15.38 90 top
Q3  17.58,25.23 90 top
Q4  15.67,10.94 90 bottom
Q5  8.37,9.35 180 bottom
Q6  15.67,19.83 90 bottom
Q7  8.37,19.19 180 bottom
Q8  15.67,29.67 90 bottom
Q9  8.37,29.04 180 bottom
R1  31.71,14.43 270 top
R2  32.18,17.13 180 top
R3  31.71,19.83 90 top
R4  29.01,13.96 180 top
R5  29.01,17.13 180 top
R6  29.01,20.31 180 top
R7  29.02,11.78 0 top
R8  29.01,9.67 0 top
R9  29.01,7.61 0 top
R10  29.01,28.88 0 top
R11  29.01,26.18 180 top
R12  29.01,23.48 180 top
R13  38.42,6.34 180 top
R14  38.42,4.12 180 top
R15  34.45,4.12 0 top
R16  41.28,5.49 90 top
R17  19.48,10.3 180 top
R18  19.48,8.4 180 top
R19  15.67,8.4 180 top
R20  1.54,26.34 270 bottom
R21  19.48,12.21 180 top
R22  15.67,12.53 180 top
R23  19.48,20.15 180 top
R24  19.48,18.24 180 top
R25  15.67,18.24 180 top
R26  19.48,22.05 180 top
R27  15.67,22.05 0 top
R28  19.48,29.99 180 top
R29  19.48,28.08 180 top
R30  15.67,28.08 180 top
R31  19.48,31.89 180 top
R32  15.67,31.89 0 top
R33  12.5,24.91 90 bottom
R34  45.56,12.53 180 top
R35  34.45,6.34 0 top
U1  39.92,17.77 180 top
U2  40.28,27.93 90 top
U$1  14.56,2.53 0 top
U$2  10.43,2.53 0 top
U$3  17.74,5.22 180 bottom
U$4  1.07,12.84 90 top
U$5  2.07,8.69 270 bottom
U$6  3.58,18.65 90 bottom
U$7  1.93,29.61 270 bottom
U$8  23.29,7.13 90 top
U$9  10.1,31.95 0 top
U$10  26.94,17.77 0 top
U$11  35.52,9.35 90 top
U$12  40.6,9.35 90 top
U$13  43.14,9.35 90 top
U$14  38.06,9.35 90 top
U$16  26.15,12.53 90 top
U$17  48.38,6.81 90 top
Y1  45.2,23.32 180 top

### Tracks (layer width: path | path; a pad name or v marks a point on that pad's centre or on a via)
CENTER  (via drill 0.5)
  Top 0.305: R1.1 31.76,15.28 32.74,16.26 | 32.74,16.26 32.98,16.5 32.98,17.07 R2.1 32.98,17.19 32.98,17.77 31.76,18.98 R3.1 | U1.10 41.92,22.74 42.66,23.48 42.66,25.7 v42.5,25.86 | v33.14,15.54 33.14,15.86 32.74,16.26
  Bottom 0.305: v42.5,25.86 42.5,26.18 41.71,26.97 33.45,26.97 32.02,25.54 32.02,23.8 34.25,21.58 34.25,16.65 v33.14,15.54
CURRENT_ADC
  Bottom 0.254: U$3.VIOUT 20.57,3.77 21.86,4.91 21.86,11.86 U$8.P$4
CURRENT_ADC_FILTERED  (via drill 0.5)
  Top 0.305: C6.1 45.72,10.79 44.61,11.9 44.61,12.48 | 44.61,12.48 R34.2 | 44.61,12.48 43.76,12.48 v43.34,12.06 | U1.26 37.94,13.49 37.94,14.6 38.42,15.07 v39.21,15.07
  Bottom 0.305: v43.34,12.06 42.23,12.06 v39.21,15.07
GATE_AH  (via drill 0.5)
  Top 0.305: R19.2 14.82,7.03 v14.88,6.97
  Bottom 0.305: v14.88,6.97 14.56,7.29 14.56,12.37 14.09,12.84 Q4.G
GATE_AL  (via drill 0.5)
  Top 0.254: v14.56,13.8 14.56,12.79 R22.2 14.88,12.53 15.67,11.73 18.16,11.73 R21.2
  Top 0.305: R21.2 18.63,12.47
  Bottom 0.305: v14.56,13.8 10.75,13.8 10.28,13.32 Q5.G
GATE_BH  (via drill 0.5)
  Top 0.305: R25.2 14.82,17.07 v14.72,16.97
  Bottom 0.305: v14.72,16.97 14.72,21.26 14.24,21.73 Q6.G
GATE_BL  (via drill 0.5)
  Top 0.305: v16.15,23.32 16.52,22.95 R27.2 R26.2
  Bottom 0.305: v16.15,23.32 13.77,23.32 13.29,22.85 11.07,22.85 Q7.G
GATE_CH  (via drill 0.5)
  Top 0.305: R30.2 14.82,27.23 v14.56,26.97
  Bottom 0.305: v14.56,26.97 14.56,30.94 13.93,31.58 Q8.G
GATE_CL  (via drill 0.5)
  Top 0.305: R31.2 R32.2 16.52,33.11 v16.47,33.16
  Bottom 0.305: Q9.G 11.39,31.89 12.5,33.01 16.31,33.01 v16.47,33.16
GND  (via drill 0.5)
  Top 0.254: v19.48,7.29 19.48,6.65 19.32,6.49 Q1.2
  Top 0.305: Q2.2 20.91,16.33 v21.71,17.13 | R27.1 14.82,23.58 v15.36,24.12
  Top 0.406: v21.71,23.16 20.44,25.39 19.64,26.18 Q3.2
  Bottom 0.254: U$3.GND 17.92,7.31 18.21,7.61 19.17,7.61 v19.48,7.29
  Bottom 0.305: v8.37,23.64 8.53,23.48 11.55,23.48 12.12,24.06 R33.1 12.55,24.12 13.13,24.12 13.45,24.43 13.45,25.86 13.77,26.18 15.36,26.18 v15.36,24.12
  Bottom 0.406: U$8.P$12 23.07,29.13 22.02,28.08 22.02,23.48 v21.71,23.16 v21.71,17.13
  Bottom 0.61: Q5.S1 8.21,12.21 8.21,12.37
  Bottom 2.286: 4.24,22.05 8.37,22.05 | 4.88,31.89 8.37,31.89
  Bottom 2.54: 5.2,12.37 8.21,12.37
  other vias: 7.42,3.64 5.99,3.64 7.42,2.37 5.99,2.37 2.97,13.16 2.97,11.89 4.08,13.16 5.2,13.16 4.08,11.89 5.2,11.89 3.61,21.42 3.61,22.53 3.61,23.64 7.26,23.64 4.72,31.42 9.01,33.8 7.74,33.8 4.72,32.69 6.47,33.8
  pour Bottom (isolate 0.254, no thermals): -1.47,30.94 -1.47,35.7 9.64,35.7 9.64,30.94
  pour Bottom (isolate 0.254, no thermals): 2.34,21.1 2.34,23.96 9.64,23.96 9.64,21.1
  pour Bottom (isolate 0.254, no thermals): 2.34,11.26 2.34,13.48 9.64,13.48 9.64,11.26
  pour Bottom (isolate 0.254, no thermals): 12.34,-2.4 12.34,4.27 -1.47,4.27 -1.47,-2.4
  pour Top (isolate 0.254): 12.34,-1.13 -2.74,-1.13 -2.74,36.97 9.64,36.97 9.64,6.97 12.34,4.43
  pour Top (isolate 0.127): 19.48,-1.13 24.4,-1.13 24.4,36.97 7.26,36.97 7.26,31.58 14.4,31.58 14.4,7.13 15.99,5.54 19.48,5.54
L_CURRENT_ADC
  Top 0.305: R34.1 48.1,12.53 U$17.P$4
L_GND  (via drill 0.5)
  Top 0.305: U$16.P$1 27.42,12.53 R7.1 28.17,9.68 R8.1 R9.1 | U1.21 42.27,17.37 42.98,16.65 44.13,16.65 U1.3
  other vias: 46.31,19.04 31.71,27.29 33.55,10.24 35.52,24.91 34.09,29.35 35.36,29.35 34.88,12.69 38.85,16.34
  pour Top (isolate 0.254): 25.13,-1.22 51.18,-1.06 51.18,36.94 25.13,36.78
  pour Bottom (isolate 0.254): 25.15,-0.22 50.18,-0.06 50.18,36.94 25.15,36.78
L_PHASE_A
  Top 0.305: U$16.P$2 27.59,14.53 R4.2
L_PHASE_B
  Top 0.305: U$16.P$3 27.55,16.53 R5.2
L_PHASE_C
  Top 0.305: U$16.P$4 26.38,18.53 R6.2
L_PWM_AH
  Top 0.305: U1.32 43.13,13.47 43.61,13.96 47.52,13.96 U$17.P$5
L_PWM_AL
  Top 0.305: U1.1 46.53,14.97 U$17.P$6
L_PWM_BH
  Top 0.305: U1.2 46.22,15.77 47.26,16.65 47.26,17.7 U$17.P$7
L_PWM_BL  (via drill 0.5)
  Top 0.305: U1.9 42.72,20.85 v42.34,20.46
  Bottom 0.305: v42.34,20.46 48.03,20.46 U$17.P$8
L_PWM_CH  (via drill 0.5)
  Top 0.305: U1.11 41.12,23.06 v41.71,23.64
  Bottom 0.305: v41.71,23.64 47.55,23.64 U$17.P$9
L_PWM_CL  (via drill 0.5)
  Top 0.305: v41.23,24.75 39.8,24.75 37.9,23 37.9,22.08 U1.15
  Bottom 0.305: U$17.P$10 41.29,24.81 v41.23,24.75
L_TEMP_ADC  (via drill 0.5)
  Top 0.305: v33.29,19.19 33.29,19.04 34.09,18.24 34.09,16.97 34.56,16.5 35.56,16.5 U1.22
  Bottom 0.305: U$16.P$5 31.96,20.53 v33.29,19.19
L_VBAT  (via drill 0.5)
  Top 0.305: R10.2 v31.55,28.88
  Top 0.61: v43.3,27.13 42.5,27.13 42.34,26.97 U2.1
  Bottom 0.305: v31.55,28.88 32.82,28.88 33.93,27.77 42.66,27.77 v43.3,27.13
  Bottom 0.61: U$17.P$11 48.22,26.81 47.9,27.13 v43.3,27.13
LED_STATUS  (via drill 0.5)
  Top 0.305: U1.14 38.72,20.81 v38.37,20.46 | v31.28,5.71 31.28,4.3 LED1.2
  Bottom 0.305: v38.37,20.46 38.53,20.31 38.53,18.4 36.63,16.5 36.63,12.53 36.95,12.21 36.95,10.94 36.63,10.62 36.19,10.62 v31.28,5.71
LED_WARN  (via drill 0.5)
  Top 0.305: U1.13 39.52,23.04 v40.28,23.8 | v42.5,6.34 41.13,6.34 R16.2
  Bottom 0.305: v42.5,6.34 44.72,8.56 44.72,14.59 40.91,18.24 40.91,23.16 v40.28,23.8
MISO
  Top 0.305: 37.1,22.08 U1.16
N$2
  Top 0.305: R18.2 18.53,8.4 17.1,7.13 17.1,5.69 Q1.1
N$3
  Top 0.305: R16.1 42.12,4.64 42.23,4.76 42.88,4.76 LED2.1
N$4
  Top 0.305: R17.1 20.33,9.88 19.8,9.35 17.48,9.35 R19.1 16.52,6.06 Q1.3
N$5
  Top 0.305: R24.2 18.21,18.24 17.58,17.61 17.58,15.53 Q2.1
N$6
  Top 0.305: R23.1 20.33,19.73 19.8,19.19 17.48,19.19 R25.1 16.52,15.43 Q2.3
N$7
  Top 0.305: R29.2 18.53,28.08 17.58,27.13 17.58,25.38 Q3.1
N$9
  Top 0.305: R28.1 20.33,29.73 19.64,29.04 17.48,29.04 R30.1 16.52,25.27 Q3.3
N$10
  Top 0.305: Y1.1 46.4,21.03 45.2,19.83 44.28,19.83 U1.7
N$11
  Top 0.305: Y1.3 44,20.78 U1.8
N$12  (via drill 0.5)
  Top 0.305: R17.2 C3.1 16.57,10.36 15.67,11.26 14.09,11.26 13.77,11.57 v13.77,14.75
  Bottom 0.305: D1.C 14.21,15.19 v13.77,14.75
N$15  (via drill 0.5)
  Top 0.305: R23.2 C1.1 16.57,20.2 15.67,21.1 14.09,21.1 13.77,21.42 13.77,23.8 v14.24,24.27
  Bottom 0.305: D2.C 14.21,24.31 v14.24,24.27
N$16
  Top 0.305: R15.1 33.34,4.12 32.39,5.07 32.39,6.5 32.07,6.82 30.8,6.82 29.85,5.87 28.75,5.87 LED1.1
N$19  (via drill 0.5)
  Top 0.305: R28.2 C2.1 16.57,30.68 16.31,30.94 14.09,30.94 11.86,33.16 v11.39,33.16
  Bottom 0.305: 13.13,34.08 D3.C 12.3,34.12 v11.39,33.16
PHASE_A  (via drill 0.5)
  Top 0.305: C3.2 14.09,10.3 13.61,9.83 v13.61,6.97
  Bottom 0.305: v13.61,6.97 13.61,7.45 12.82,8.24 | U$5.P$1 3.93,8.72 2.18,10.46 2.18,13.73 U$4.P$2
  Bottom 2.286: 12.82,7.45 12.82,8.24 12.82,10.94
  pour Bottom (isolate 0.254, no thermals): 13.77,5.54 12.34,5.54 12.34,4.91 -1.47,4.91 -1.47,10.62 11.23,10.62 11.23,12.21 13.77,12.21
PHASE_B  (via drill 0.5)
  Top 0.305: C1.2 14.4,20.15 13.77,19.51 13.77,17.13 v13.45,16.81
  Bottom 0.305: v13.45,16.81 12.82,17.29 | U$6.P$1 1.83,17.61 U$4.P$3
  Bottom 2.286: 12.82,17.29 12.82,19.51
  pour Bottom (isolate 0.254, no thermals): 2.34,14.11 2.34,20.46 11.23,20.46 11.23,21.1 13.77,21.1 13.77,14.11
PHASE_C  (via drill 0.5)
  Top 0.305: C2.2 14.72,29.99 14.4,30.31 v11.07,30.31
  Bottom 0.305: v11.07,30.31 11.07,29.67 12.82,29.67 | 3.93,25.86 2.34,24.43 2.34,20.27 U$4.P$4
  Bottom 1.016: 11.23,27.45 13.45,27.45
  Bottom 2.286: 12.82,29.67 12.82,28.08
  pour Bottom (isolate 0.254, no thermals): 0.43,24.59 0.43,30.31 11.23,30.31 11.23,30.94 13.77,30.94 13.77,24.59
PWM  (via drill 0.5)
  Top 0.305: v39.49,19.99 40.28,20.78 40.28,22.01 U1.12 | R35.2 35.72,6.34 | 38.1,8.72 38.1,9.31 U$14.P$1
  Top 0.406: v38.06,12.05 U$14.P$1 | 35.72,6.34 38.1,8.72
  Bottom 0.305: v38.06,12.05 37.26,12.84 37.26,16.18 39.49,18.4 v39.49,19.99
PWM_AH  (via drill 0.5)
  Top 0.305: R18.1 20.91,8.4 21.39,8.88 v21.39,13.22
  Bottom 0.254: v21.39,13.22 U$8.P$5
PWM_AL  (via drill 0.5)
  Top 0.254: 20.33,13.22 20.33,14.17 v20.91,14.75
  Top 0.305: R21.1 20.33,13.22
  Bottom 0.254: v20.91,14.75 U$8.P$6
PWM_BH
  Top 0.305: R24.1 22.41,18.24 U$8.P$7
PWM_BL
  Top 0.305: R26.1 22.37,22.05 U$8.P$8
PWM_CH
  Top 0.305: R29.1 20.33,27.08 22.02,25.39 22.02,24.4 U$8.P$9
PWM_CL
  Top 0.305: R31.1 20.91,31.89 21.39,31.42 21.39,27.03 U$8.P$10
RESET  (via drill 0.5)
  Top 0.305: R12.1 31.49,23.48 C5.1 32.72,23.96 v33.14,23.96 | v40.28,16.02 40.12,15.86 40.28,15.7 40.28,13.52 U1.29
  Bottom 0.305: v33.14,23.96 38.53,23.96 40.28,22.21 v40.28,16.02
RX
  Top 0.305: U1.30 41.12,12.95
SCL
  Top 0.305: U1.28 39.52,12.7 40.8,11.42 42.55,11.42 | 43.18,10.79 43.18,9.4 U$13.P$1 43.18,9.31 43.18,8.25 | 42.23,7.3 40.64,7.3 40.32,6.98 40.32,4.86 R14.1
  Top 0.406: 42.55,11.42 43.18,10.79 | 42.23,7.3 43.18,8.25
SDA
  Top 0.305: U1.27 38.72,12.71 39.37,12.06 | 40.48,10.95 40.48,9.47 U$12.P$1 40.17,8.92 40.17,8.41 | 39.37,6.44 R13.1
  Top 0.406: 40.48,10.95 39.37,12.06 39.37,6.44
SENSE_A
  Top 0.305: R7.2 R4.1 31.33,13.96 R1.2 32.29,13.58 34.56,15.86 35.54,15.86 U1.23
SENSE_B  (via drill 0.5)
  Top 0.305: v29.01,15.7 29.86,16.55 R5.1 R2.2 | R8.2 30.6,9.67 31.23,10.3 v31.23,10.62 32.66,12.05 32.66,13.16 34.46,14.97 U1.24
  Bottom 0.305: v29.01,15.7 29.01,12.84 v31.23,10.62
SENSE_C  (via drill 0.5)
  Top 0.305: R9.2 30.6,7.61 31.23,8.24 v31.23,8.72 32.18,9.67 32.18,10.78 33.29,11.89 33.29,13 34.56,14.27 35.68,14.27 36.32,13.47 U1.25 | R3.2 31.33,20.31 R6.1 29.86,18.98 v30.12,18.72
  Bottom 0.305: v30.12,18.72 30.12,18.56 28.21,16.65 28.21,11.73 v31.23,8.72
TEMP_ADC  (via drill 0.5)
  Top 0.305: v4.4,24.75 2.97,24.75 | 2.97,24.75 2.34,24.12 2.34,22.11 U$4.P$5 | v3.02,27.14 3.02,24.8 2.97,24.75
  Bottom 0.305: R33.2 12.5,25.54 11.39,24.43 4.72,24.43 v4.4,24.75 | R20.1 2.97,27.19 v3.02,27.14
VBAT  (via drill 0.5)
  Top 0.406: U$8.P$11 23.29,27.45 22.18,28.56 v22.18,30.78
  Bottom 0.305: D3.A 16.94,34.12 18.05,33.01 18.05,31.42 18.69,30.78
  Bottom 0.406: v22.18,30.78 18.69,30.78 Q8.D
  pour Bottom (no thermals): 14.4,5.54 14.4,36.34 24.4,36.34 24.4,5.54
VBAT+  (via drill 0.5)
  other vias: 17.74,1.91 16.94,3.16
  pour Bottom (isolate 0.254, no thermals): 12.97,-0.65 12.97,4.91 18.85,4.91 18.85,-2.4 16.31,-1.13
  pour Top (isolate 0.254): 12.97,-1.13 12.97,4.59 10.28,7.29 10.28,30.94 13.77,30.94 13.77,6.81 15.67,4.91 18.85,4.91 18.85,-1.13
VBAT_ADC  (via drill 0.5)
  Top 0.305: U1.19 34.79,18.97 33.29,20.46 v33.29,21.1 | R11.2 27.42,26.92 v27.42,27.45 27.42,28.08 28.16,28.82 R10.1
  Bottom 0.305: v33.29,21.1 28.53,21.1 27.42,22.21 v27.42,27.45
VCC5V  (via drill 0.5)
  Top 0.305: U$16.P$6 27.2,22.53 R12.2 28.16,22.9 29.01,22.05 34.09,22.05 34.25,21.89 | 35.55,18.08 U1.20 36.71,18.17 v37.58,19.04 37.65,18.97 | C4.1 34.25,21.89 | 34.25,21.89 34.25,20.31 34.72,19.83 35.57,19.83 U1.18 | v35.83,21.89 34.25,21.89 | 45.36,25.98 C7.1 | U1.6 41.71,18.97 | v36.46,5.23 R14.2 | v36.46,5.23 R13.2 | R15.2 35.35,4.12 v36.46,5.23 | U2.5 38.98,26.76 38.9,26.68
  Top 0.406: 37.65,18.97 41.71,18.97 43.31,17.37 U1.4 44.3,17.29 v45.84,17.29 | 45.36,25.98 45.36,27.77 v44.57,28.56 | v37.1,28.72 37.1,27.95 C9.A 36.44,26.98
  Top 0.61: v35.83,21.89 35.83,22.85 36.47,23.48 36.47,26.94 C9.A
  Top 0.813: U2.5 36.44,26.98
  Top 1.016: 36.83,26.19 38.74,26.19 38.74,26.82 38.9,26.82 38.9,26.68 38.9,25.39 36.67,25.39
  Bottom 0.406: v45.84,17.29 46.63,16.5 46.63,12.05 47.87,10.81 U$17.P$3 47.94,10.38 47.94,10.31 43.02,5.39 36.62,5.39 v36.46,5.23 | v44.57,28.56 37.58,28.56 v37.1,28.72
  Bottom 0.61: v35.83,21.89 35.83,20.78 v37.58,19.04
VCC5V-1
  Bottom 0.305: U$4.P$6 1.07,22.97 1.59,23.49 1.59,25.44 R20.2
VCC5V-2  (via drill 0.5)
  Top 0.305: v19.48,3 19.48,4.96 C10.1
  Bottom 0.254: U$8.P$3 23.29,11.1 22.29,10.07 22.29,4.51 20.91,3.32 19.8,3.32 v19.48,3
  Bottom 0.305: U$3.VCC 17.92,2.98 18.05,2.84 19.32,2.84 v19.48,3

### Text on the board
Reference: VSCORE
tDocu: GND | V+ | rev8 | 5V | T | C | B | A | BLK | R/Y | WHT | GRN | GND | 5V | GND | PWM | SDA | SCL | BlueESC | B | R | rev8 | GND | + | -
bDocu: C | BLUESC-ELEC-POWER-R1 | B | A | BLUEESC-ELEC-LOGIC | 9/15 | Designed by R. Jehangir | BlueRobotics